# Altium schematic sheet rf_lpf.SchDoc: mcHF Pro Transceiver RF board
size A3; Author: Krassi Atanassov; CompanyName: MØNKA; Engineer: For radio amateurs experimentation, non-commercial use only. Thank you!; Revision: 0.8.2; SheetTotal: 14
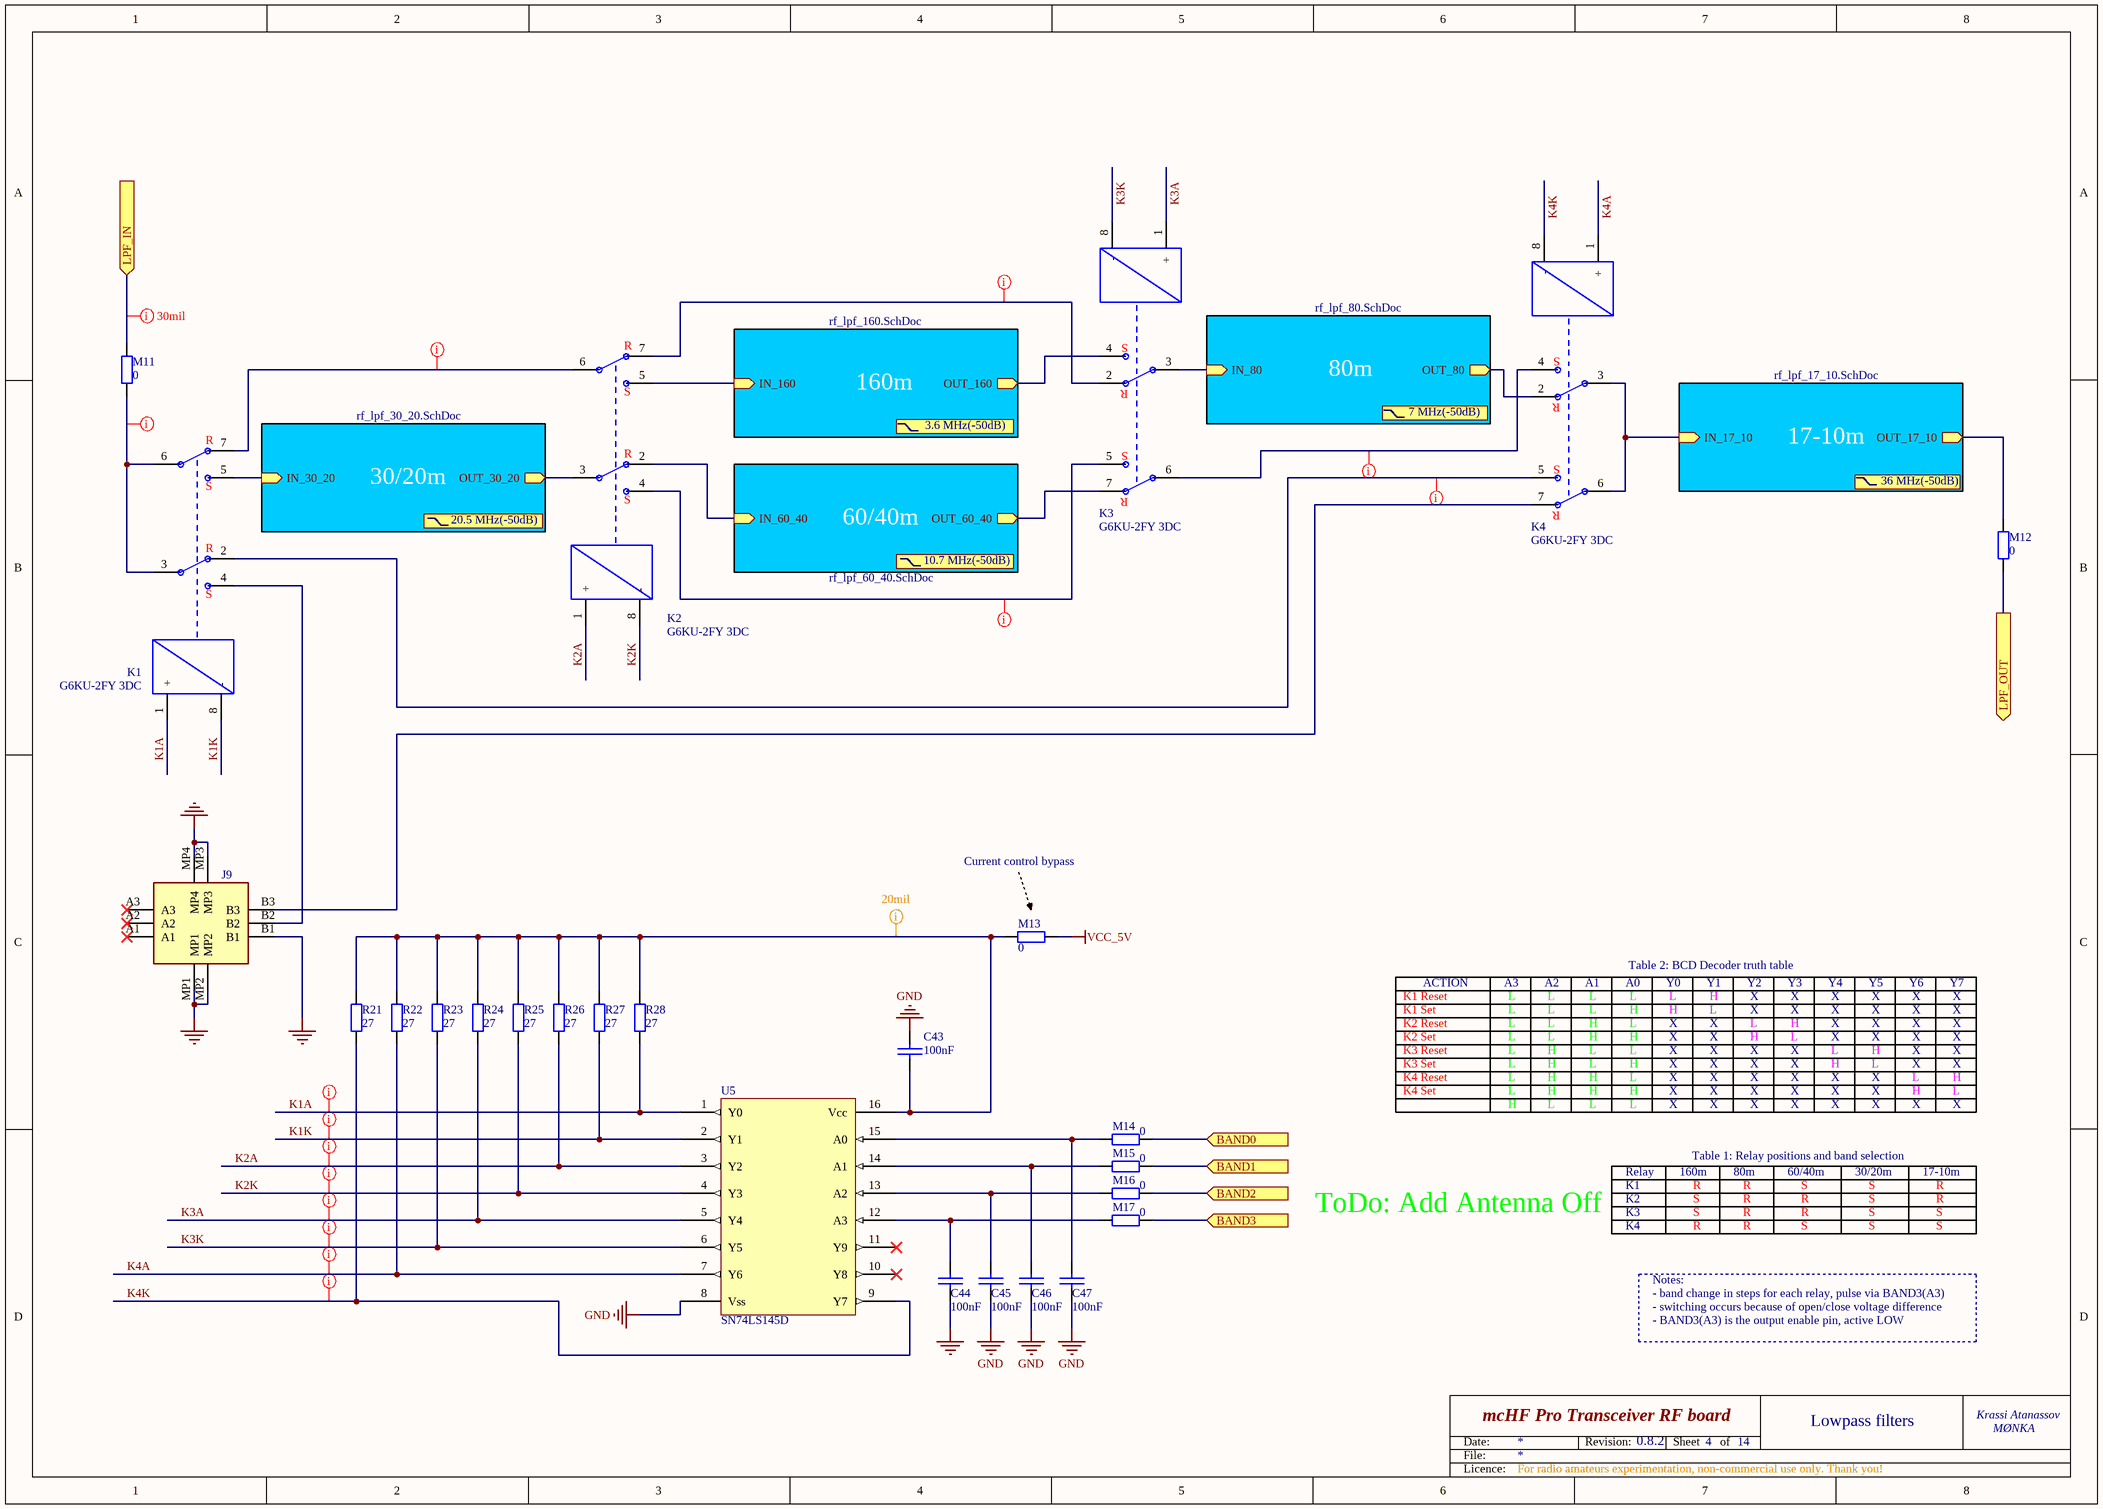
[diagram p0: rf_lpf.SchDoc]

## Parts
C43  100nF  [0805]
C44  100nF  [0805]
C45  100nF  [0805]
C46  100nF  [0805]
C47  100nF  [0805]
J9  1373826  [1373826]  (value not drawn)
K1  G6KU-2FY 3DC  [Omron_2FY-Pro]
K2  G6KU-2FY 3DC  [Omron_2FY-Pro]
K3  G6KU-2FY 3DC  [Omron_2FY-Pro]
K4  G6KU-2FY 3DC  [Omron_2FY-Pro]
M11  0  [0805]
M12  0  [0805]
M13  0  [0805]
M14  0  [0805]
M15  0  [0805]
M16  0  [0805]
M17  0  [0805]
R21  27  [1206]
R22  27  [1206]
R23  27  [1206]
R24  27  [1206]
R25  27  [1206]
R26  27  [1206]
R27  27  [1206]
R28  27  [1206]
U5  SN74LS145D  [SO-16]

## Sub-sheets
17-10m = rf_lpf_17_10.SchDoc: IN_17_10 (in), OUT_17_10 (out)
30/20m = rf_lpf_30_20.SchDoc: IN_30_20 (in), OUT_30_20 (out)
60/40m = rf_lpf_60_40.SchDoc: IN_60_40 (in), OUT_60_40 (out)
80m = rf_lpf_80.SchDoc: IN_80 (in), OUT_80 (out)
160m = rf_lpf_160.SchDoc: IN_160 (in), OUT_160 (out)

## Ports
BAND0 (in), BAND1 (in), BAND2 (in), BAND3 (in), LPF_IN (in), LPF_OUT (out)

## Nets
GND: C43.2 C44.1 C45.1 C46.1 C47.1 J9.B1 J9.MP1 J9.MP2 J9.MP3 J9.MP4 U5.8(Vss)
VCC_5V: M13.2
BAND0: M14.1 ; port BAND0
BAND1: M15.1 ; port BAND1
BAND2: M16.1 ; port BAND2
BAND3: M17.1 ; port BAND3
K1A: K1.1(+) R28.1 U5.1(Y0)
K1K: K1.8(-) R27.1 U5.2(Y1)
K2A: K2.1(+) R26.1 U5.3(Y2)
K2K: K2.8(-) R25.1 U5.4(Y3)
K3A: K3.1(+) R24.1 U5.5(Y4)
K3K: K3.8(-) R23.1 U5.6(Y5)
K4A: K4.1(+) R22.1 U5.7(Y6)
K4K: K4.8(-) R21.1 U5.9(Y7)
LPF_IN: M11.2 ; port LPF_IN
LPF_OUT: M12.2 ; port LPF_OUT
NetC43_1: C43.1 M13.1 R21.2 R22.2 R23.2 R24.2 R25.2 R26.2 R27.2 R28.2 U5.16(Vcc)
NetC44_2: C44.2 M17.2 U5.12(A3)
NetC45_2: C45.2 M16.2 U5.13(A2)
NetC46_2: C46.2 M15.2 U5.14(A1)
NetC47_2: C47.2 M14.2 U5.15(A0)
NetJ9_B2: J9.B2 K1.4
NetJ9_B3: J9.B3 K4.7
NetK1_2: K1.2 K4.5
NetK1_3: K1.3 K1.6 M11.1
NetK1_5: K1.5 ; sheet 30/20m/IN_30_20
NetK1_7: K1.7 K2.6
NetK2_2: K2.2 ; sheet 60/40m/IN_60_40
NetK2_3: K2.3 ; sheet 30/20m/OUT_30_20
NetK2_4: K2.4 K3.5
NetK2_5: K2.5 ; sheet 160m/IN_160
NetK2_7: K2.7 K3.2
NetK3_3: K3.3 ; sheet 80m/IN_80
NetK3_4: K3.4 ; sheet 160m/OUT_160
NetK3_6: K3.6 K4.4
NetK3_7: K3.7 ; sheet 60/40m/OUT_60_40
NetK4_2: K4.2 ; sheet 80m/OUT_80
NetK4_3: K4.3 K4.6 ; sheet 17-10m/IN_17_10
NetM12_1: M12.1 ; sheet 17-10m/OUT_17_10

Not connected (* = marked no-connect by the designer): J9 A1* A2* A3*; U5 10(Y8)* 11(Y9)*

## Layout directives
rule Width Constraint [Pref Width = 30mil    Min Width = 30mil    Max Width = 30mil]: LPF_IN, NetK1_2, NetK1_3, NetK1_7, NetK2_4, NetK2_7, NetK3_6
rule Width Constraint [Pref Width = 20mil    Min Width = 20mil    Max Width = 20mil]: K1A, K1K, K2A, K2K, K3A, K3K, K4A, K4K, NetC43_1

## Notes on the sheet
- 3.6 MHz(-50dB)
- 7 MHz(-50dB)
- 36 MHz(-50dB)
- (near K2) 20.5 MHz(-50dB)
- 10.7 MHz(-50dB)
- Current control bypass
- ACTION
- A3
- A2
- A1
- A0
- Table 2: BCD Decoder truth table
- Y0
- Y1
- Y2
- Y3
- Y4
- Y5
- Y6
- Y7
- K1 Reset
- K1 Set
- K2 Reset
- K3 Reset
- K2 Set
- L
- H
- X
- K4 Reset
- K3 Set
- K4 Set
- Relay
- K1
- 160m
- Table 1: Relay positions and band selection
- R
- 80m
- 60/40m
- S
- 30/20m
- 17-10m
- ToDo: Add Antenna Off
- K2
- K3
- K4
- - band change in steps for each relay, pulse via BAND3(A3)
- Notes:
- - switching occurs because of open/close voltage difference
- - BAND3(A3) is the output enable pin, active LOW
- 4
- Lowpass filters
- Date:
- File:
- Revision:
- Sheet
- of
- Licence:
- (in symbol G6KU-2FY 3DC) R; S

## Library data of the parts
C43-C47 = CAP: Capacitor; QT Order: QCC-00154; Price: 0.068
J9 = 1373826: SMD male connector, nominal current: 2.2 A, Test voltage: 840 VAC, number of positions: 6, pitch: 1.27 mm, color: black, contact surface: Gold, type of contact: Male connector, mounting: SMD soldering; Manufacturer_Name: Phoenix Contact; Geometry.Height: 6.75mm; Mouser Part Number: 651-1373826; Mouser Price/Stock: https://www.mouser.co.uk/ProductDetail/Phoenix-Contact/1373826?qs=2SLPxufLcgB13Clq%252BEBMrA%3D%3D; Manufacturer_Part_Number: 1373826; Datasheet Link: http://www.phoenixcontact.com/gb/produkte/1373826
K1-K4 = G6KU-2FY 3DC: Single-winding Latching Relay; Order: FN 118-1070; Price: 2.19
M11-M17 = RES: Resistor; QT Order: QCR-00268; Price: 0.009
R21-R28 = RES: Resistor; QT Order: QCR-00427; Price: 0.017
U5 = SN74LS145D: BCD DECODER/DRIVER; Price: 1.22